# EAGLE design alarm3 (EAGLE 5.10)
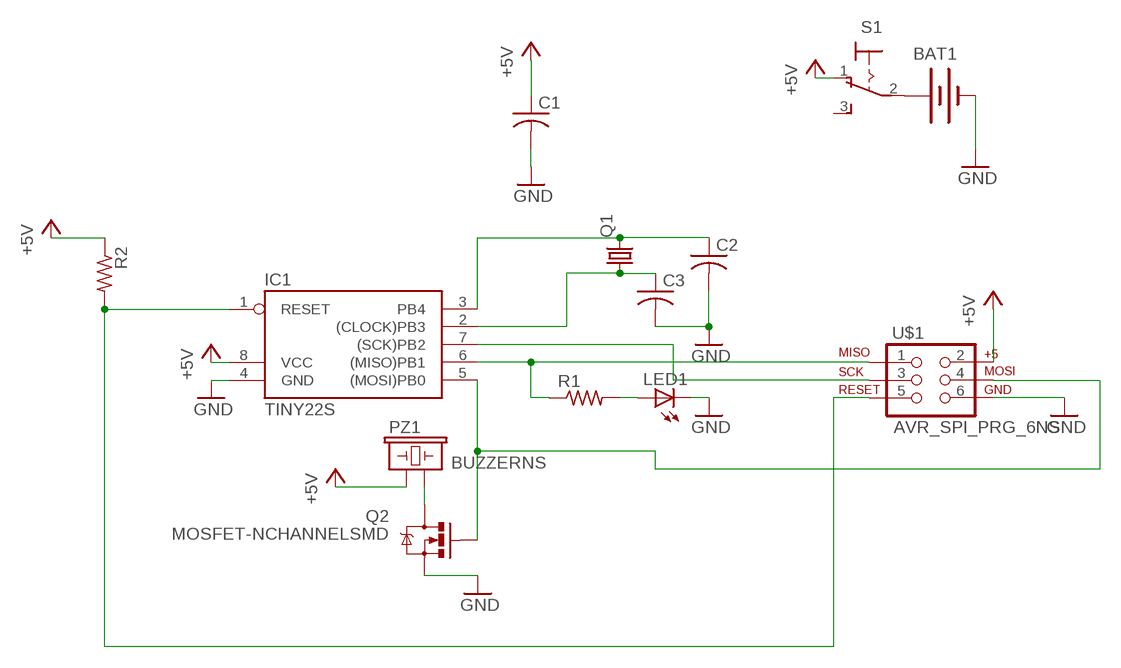
[diagram p0: schematic, sheet 1]

## Parts
BAT1  BATTERY245MM  [BATTCON_245MM]
C1  C-USC4532  [C4532]
C2  C-USC1206K  [C1206K]
C3  C-USC1206K  [C1206K]
IC1  TINY22S  [SOIC8]
LED1  LEDSMT1206  [1206]
PZ1  BUZZERNS  [BUZZER-12MM-NS]
Q1  CRYSTALTC38H  [TC38H]
Q2  MOSFET-NCHANNELSMD  [SOT23-3]
R1  R-US_M1206  [M1206]
R2  R-US_M1206  [M1206]
S1  320-916  [320-916]
U$1  AVR_SPI_PRG_6NS  [2X3-NS]

## Nets
+5V: C1.1 IC1.8(VCC) PZ1.+ R2.1 S1.1(O) U$1.2
GND: BAT1.2(-) C1.2 C2.2 C3.2 IC1.4(GND) LED1.C Q2.2(S) U$1.6
N$1: C3.1 IC1.2((CLOCK)PB3) Q1.1
N$2: C2.1 IC1.3(PB4) Q1.2
N$3: IC1.5((MOSI)PB0) Q2.1(G) U$1.4
N$4: IC1.6((MISO)PB1) R1.1 U$1.1
N$5: LED1.A R1.2
N$6: PZ1.- Q2.3(D)
N$7: BAT1.1(+) S1.2(P)
N$8: IC1.7((SCK)PB2) U$1.3
N$9: IC1.1(RESET) R2.2 U$1.5
Unconnected: S1.3(S)

## Library data of the parts
BAT1 = SparkFun:BATTERY: Battery Holders Various common sizes : AA, AAA, 20mm coin cell and 12mm coin cell.
C1-C3 = rcl:C-US: CAPACITOR, American symbol
IC1 = atmel:TINY22: MICROCONTROLLER 1K ROM 128 bytes RAM 128 bytes EEPROM
LED1 = led:LED: LED OSRAM: - CHIPLED LG R971, LG N971, LY N971, LG Q971, LY Q971, LO R971, LY R971 LH N974, LH R974 LS Q976, LO Q976, LY Q976 LO Q996 - Hyper CHIPLED LW Q18S LB Q993, LB Q99A, LB R99A - SideLED LS A670, LO A670, LY A670, LG A670, LP A670 LB A673, LV A673, LT A673, LW A673 LH A674 LY A675 LS A676, LA A676, LO A676, LY A676, LW A676 LS A679, LY A679, LG A679 - Hyper Micro SIDELED® LS Y876, LA Y876, LO Y876, LY Y876 LT Y87S - SmartLED LW L88C, LW L88S LB L89C, LB L89S, LG L890 LS L89K, LO L89K, LY L89K LS L896, LA L896, LO L896, LY L896 - TOPLED LS T670, LO T670, LY T670, LG T670, LP T670 LSG T670, LSP T670, LSY T670, LOP T670, LYG T670 LG T671, LOG T671, LSG T671 LB T673, LV T673, LT T673, LW T673 LH T674 LS T676, LA T676, LO T676, LY T676, LB T676, LH T676, LSB T676, LW T676 LB T67C, LV T67C, LT T67C, LS T67K, LO T67K, LY T67K, LW E67C LS E67B, LA E67B, LO E67B, LY E67B, LB E67C, LV E67C, LT E67C LW T67C LS T679, LY T679, LG T679 LS T770, LO T770, LY T770, LG T770, LP T770 LB T773, LV T773, LT T773, LW T773 LH T774 LS E675, LA E675, LY E675, LS T675 LS T776, LA T776, LO T776, LY T776, LB T776 LHGB T686 LT T68C, LB T68C - Hyper Mini TOPLED® LB M676 - Mini TOPLED Santana® LG M470 LS M47K, LO M47K, LY M47K Source: http://www.osram.convergy.de LUXEON: - LUMILED® LXK2-PW12-R00, LXK2-PW12-S00, LXK2-PW14-U00, LXK2-PW14-V00 LXK2-PM12-R00, LXK2-PM12-S00, LXK2-PM14-U00 LXK2-PE12-Q00, LXK2-PE12-R00, LXK2-PE12-S00, LXK2-PE14-T00, LXK2-PE14-U00 LXK2-PB12-K00, LXK2-PB12-L00, LXK2-PB12-M00, LXK2-PB14-N00, LXK2-PB14-P00, LXK2-PB14-Q00 LXK2-PR12-L00, LXK2-PR12-M00, LXK2-PR14-Q00, LXK2-PR14-R00 LXK2-PD12-Q00, LXK2-PD12-R00, LXK2-PD12-S00 LXK2-PH12-R00, LXK2-PH12-S00 LXK2-PL12-P00, LXK2-PL12-Q00, LXK2-PL12-R00 Source: www.luxeon.com KINGBRIGHT: KA-3528ASYC Source: www.kingbright.com
PZ1 = SparkFun10-6-08:BUZZER: Buzzer 12mm Spark Fun Electronics SKU : Comp-Buzzer
Q1 = crystal:CRYSTAL: CRYSTAL
Q2 = SparkFun10-6-08:MOSFET-NCHANNEL
R1 = resistor:R-US_: RESISTOR, American symbol
R2 = rcl:R-US_: RESISTOR, American symbol
S1 = switch:320-916: TOGGLE SWITCH distributor RS Components
U$1 = SparkFun10-6-08:AVR_SPI_PRG_6: AVR ISP 6 Pin This is the reduced ISP connector for AVR programming. Common on Arduino. This footprint will take up less PCB space and can be used with a 10-pin to 6-pin adapter such as SKU: BOB-08508

## Net classes
0 default: width 0.508 mm, drill 0.762 mm, clearance 0.254 mm

## Board
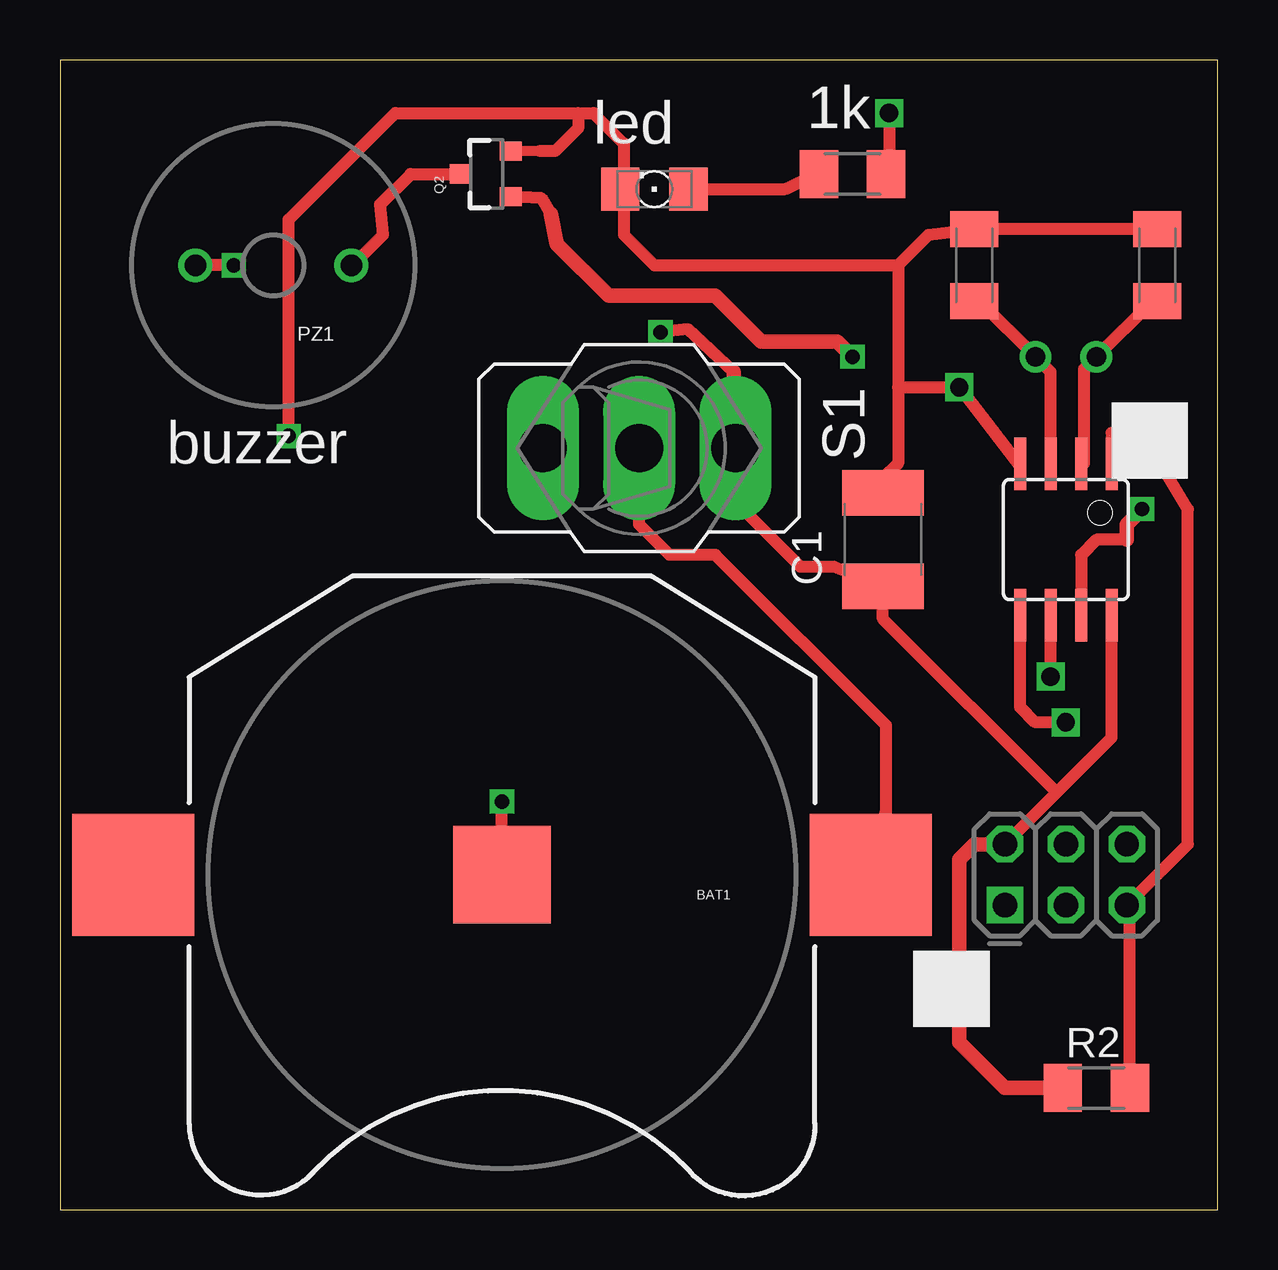
[diagram p1: board, top side]
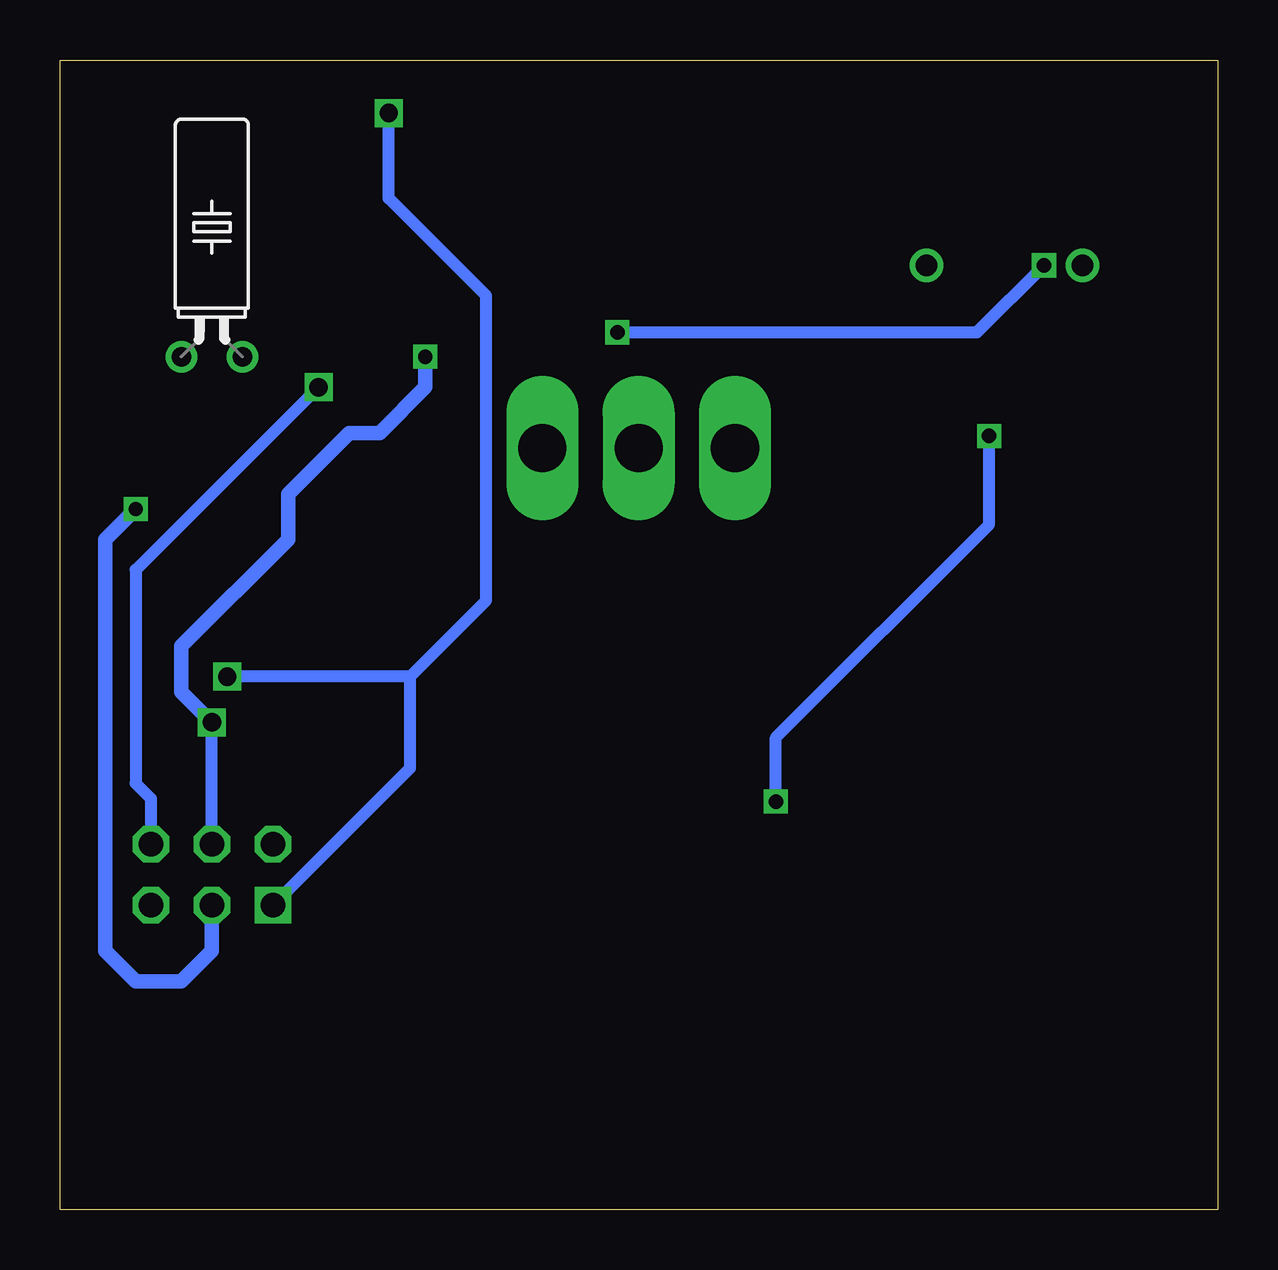
[diagram p2: board, bottom side, seen from below]

Size 48.24 x 47.93 mm. Coordinates in mm from the lower left corner, seen from the top.
Outline: 0,0 48.24,0 48.24,47.93 0,47.93 0,0
Copper layers (1*16): Top 0.035mm / dielectric 1.5mm / Bottom 0.035mm
Design rules "default": minimum track width 10mil, minimum drill 24mil, track to track 8mil, track to pad 8mil, pad to pad 8mil, via to via 8mil, smd to smd 8mil, copper to edge 40mil, drill to drill 8mil, minimum pad ring 10mil, minimum via ring 8mil, stop-mask expansion 4mil, vias tented up to drill 0mil, thermal gap 10mil

### Footprints (pad centres in the part's own frame; a part is rotated, then mirrored left to right if it is on the bottom)
BATTCON_245MM = smd 5.08 x 5.08: 1 -15.367,0; 3 15.367,0 | smd 4.064 x 4.064: 2 0,0
C4532 = smd 1.9 x 3.4: 1 -1.95,0; 2 1.95,0
C1206K = smd 1.5 x 2: 1 -1.5,0; 2 1.5,0
SOIC8 = smd 0.5 x 2.2: 1 -1.905,-3.154; 2 -0.645,-3.154; 3 0.625,-3.154; 4 1.895,-3.154; 5 1.905,3.154; 6 0.635,3.154; 7 -0.635,3.154; 8 -1.905,3.154
1206 = smd 1.6 x 1.803: A -1.422,0; C 1.422,0
BUZZER-12MM-NS = drill 0.9 round: + 3.25,0; - -3.25,0
TC38H = drill 0.813 round: 1 -1.27,0; 2 1.27,0
SOT23-3 = smd 0.8 x 0.9: 1 -0.95,-1; 2 0.95,-1; 3 0,1.1
M1206 = smd 1.6 x 2: 1 -1.4,0; 2 1.4,0
320-916 = drill 2.007 long: 1 0,4.013; 2 0,0; 3 0,-4.013
2X3-NS = drill 1.016 square: 1 -2.54,-1.27 | drill 1.016 octagon: 2 -2.54,1.27; 3 0,-1.27; 4 0,1.27; 5 2.54,-1.27; 6 2.54,1.27

### Placement (x,y rotation side)
BAT1  18.41,13.97 180 top
C1  34.29,27.94 90 top
C2  38.1,39.37 90 top
C3  45.72,39.37 90 top
IC1  41.91,27.94 180 top
LED1  24.77,42.55 180 top
PZ1  8.89,39.37 180 top
Q1  41.91,35.56 0 bottom
Q2  17.78,43.18 90 top
R1  33.02,43.18 180 top
R2  43.18,5.08 0 top
S1  24.13,31.75 270 top
U$1  41.91,13.97 0 top

### Tracks (layer width: path | path; a pad name or v marks a point on that pad's centre or on a via)
+5V  (via drill 0.6)
  Top 0.508: 41.53,17.4 43.81,19.68 IC1.8 | U$1.2 41.53,17.4 | 41.53,17.4 34.29,24.64 C1.1 32.26,26.8 30.86,26.8 28.19,29.46 28.19,30.48 S1.1 | v25.02,36.58 26.16,36.7 28.07,34.92 | v7.24,39.37 PZ1.+
  Top 0.61: U$1.2 38.1,15.24 37.47,14.61 37.47,6.99 39.37,5.08 R2.1 | S1.1 28.07,34.92
  Bottom 0.508: v7.24,39.37 10.03,36.58 v25.02,36.58 | S1.1 28.07,31.75
GND  (via drill 0.6, 0.76)
  Top 0.406: 20,44.13 Q2.2
  Top 0.508: 34.92,34.29 v37.47,34.29 40.01,30.99 IC1.4 | 34.92,34.29 34.92,31.11 34.29,30.48 34.29,29.97 C1.2 | C3.2 45.72,40.89 38.1,40.89 C2.2 36.2,40.64 34.92,39.37 | 34.92,39.37 24.77,39.37 23.5,40.64 23.5,42.42 LED1.C 23.5,42.06 23.5,44.45 22.23,45.72 21.59,45.72 | BAT1.2 v18.41,17.02 | v9.53,32.26 9.53,41.27 13.97,45.72 21.59,45.72 | 34.92,39.37 34.92,34.29 | 20,44.13 20.64,44.13 21.59,45.09 21.59,45.72
  Bottom 0.508: U$1.6 44.45,17.14 45.09,17.78 45.09,26.67 v37.47,34.29 | v18.41,17.02 18.41,19.68 9.53,28.57 v9.53,32.26
N$1
  Top 0.508: C3.1 45.72,37.85 45.47,37.85 Q1.1 42.67,35.05 42.67,31.11 IC1.2
N$2
  Top 0.508: C2.1 38.1,37.85 38.35,37.85 Q1.2 41.27,34.92 41.27,31.11 IC1.3
N$3  (via drill 0.6, 0.76)
  Top 0.508: 20.45,41.53 20.07,42.16 Q2.1 | 40.01,24.89 IC1.5 40.01,20.95 40.64,20.32 v41.91,20.32
  Top 0.61: 20.45,41.53 20.7,40.26 22.86,38.1 27.3,38.1 29.21,36.2 32.38,36.2 v33.02,35.56
  Bottom 0.508: U$1.4 v41.91,20.32
  Bottom 0.61: v33.02,35.56 33.02,34.29 34.92,32.38 36.2,32.38 38.73,29.84 38.73,27.94 43.18,23.5 43.18,21.59 v41.91,20.32
N$4  (via drill 0.76)
  Top 0.508: v34.54,45.72 34.54,43.18 R1.1 | v41.27,22.23 IC1.6
  Bottom 0.508: 33.66,22.23 33.66,18.41 U$1.1 | 33.66,22.23 30.48,25.4 30.48,38.1 34.54,42.16 v34.54,45.72 | 33.66,22.23 v41.27,22.23
N$5
  Top 0.508: LED1.A 30.23,42.55 31.5,43.18 R1.2
N$6
  Top 0.508: Q2.3 14.61,43.18 13.34,41.91 13.46,40.64 12.19,39.37 PZ1.-
N$7
  Top 0.508: BAT1.1 34.42,16.64 34.42,20.19 27.3,27.3 25.4,27.3 24.13,28.57 S1.2
N$8  (via drill 0.6)
  Top 0.508: 44.45,27.94 43.18,27.94 42.55,27.3 IC1.7
  Top 0.61: 44.45,27.94 44.45,28.57 v45.09,29.21
  Bottom 0.61: v45.09,29.21 46.35,27.94 46.35,10.79 45.09,9.53 43.18,9.53 41.91,10.79 U$1.3
N$9
  Top 0.508: R2.2 44.58,12.57 U$1.5 46.99,15.24 46.99,29.21 45.09,32.38 43.81,32.38 IC1.1

### Text on the board
tPlace: 1k | led | buzzer